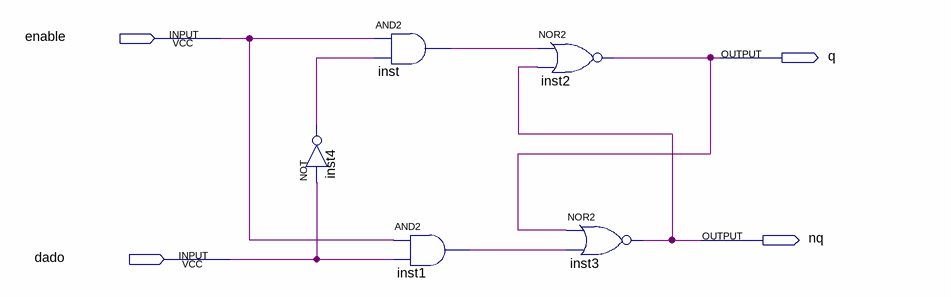
[diagram p0: schematic sheet]
// Quartus schematic FlipFlop.bdf as structural Verilog: 5 symbols, 4 pins
module FlipFlop (
  input  enable,
  input  dado,
  output q,
  output nq
);

  wire inst1_out, inst4_out, inst_out;

  not inst4 (inst4_out, dado);
  and inst (inst_out, enable, inst4_out);
  and inst1 (inst1_out, enable, dado);
  nor inst2 (q, inst_out, nq);
  nor inst3 (nq, q, inst1_out);
endmodule
